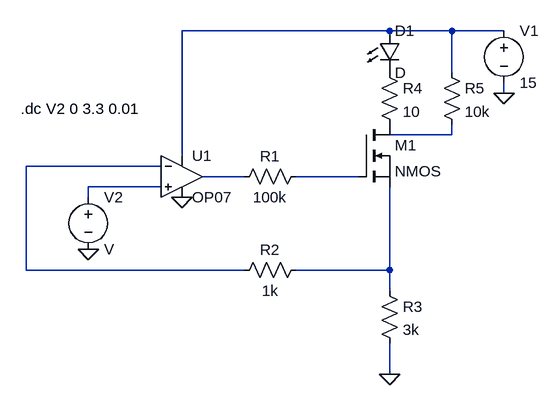
[diagram p0: schematic SimpleCurrentPump.asc]
SimpleCurrentPump.asc, the LTspice schematic file:
Version 4
SHEET 1 892 680
WIRE 656 -16 336 -16
WIRE 752 -16 656 -16
WIRE 832 -16 752 -16
WIRE 752 48 752 -16
WIRE 832 80 832 64
WIRE 752 144 752 128
WIRE 752 144 656 144
WIRE 336 176 336 -16
WIRE 304 192 96 192
WIRE 432 208 368 208
WIRE 608 208 512 208
WIRE 304 224 192 224
WIRE 192 240 192 224
WIRE 96 352 96 192
WIRE 432 352 96 352
WIRE 656 352 656 224
WIRE 656 352 512 352
WIRE 656 384 656 352
WIRE 656 512 656 464
FLAG 656 512 0
FLAG 192 320 0
FLAG 336 240 0
FLAG 832 80 0
SYMBOL Opamps/OP07 336 144 R0
SYMATTR InstName U1
SYMBOL nmos 608 128 R0
SYMATTR InstName M1
SYMBOL res 528 192 R90
WINDOW 0 0 56 VBottom 2
WINDOW 3 32 56 VTop 2
SYMATTR InstName R1
SYMATTR Value 100k
SYMBOL res 528 336 R90
WINDOW 0 0 56 VBottom 2
WINDOW 3 32 56 VTop 2
SYMATTR InstName R2
SYMATTR Value 1k
SYMBOL res 640 368 R0
SYMATTR InstName R3
SYMATTR Value 3k
SYMBOL voltage 832 -32 R0
SYMATTR InstName V1
SYMATTR Value 15
SYMBOL voltage 192 224 R0
SYMATTR InstName V2
SYMBOL LED 640 -16 R0
SYMATTR InstName D1
SYMBOL res 640 32 R0
SYMATTR InstName R4
SYMATTR Value 10
SYMBOL res 736 32 R0
SYMATTR InstName R5
SYMATTR Value 10k
TEXT 88 104 Left 2 !.dc V2 0 3.3 0.01

The netlist it stands for:
* SimpleCurrentPump.asc
XU1 N006 N003 N001 0 N004 LT1001  ; OP07, pins In+ In- V+ V- OUT
M1 P001 N005 N007 N007 NMOS
R1 N005 N004 100k
R2 N007 N003 1k
R3 N007 0 3k
V1 N001 0 15
V2 N006 0 V
D1 N001 P002 D
R4 P002 P001 10
R5 N001 N002 10k
.model D D
.lib standard.dio
.model NMOS NMOS
.model PMOS PMOS
.lib standard.mos
.dc V2 0 3.3 0.01
.lib LTC.lib
.backanno
.end